# EAGLE design SAO_3 (EAGLE 9.6.2)
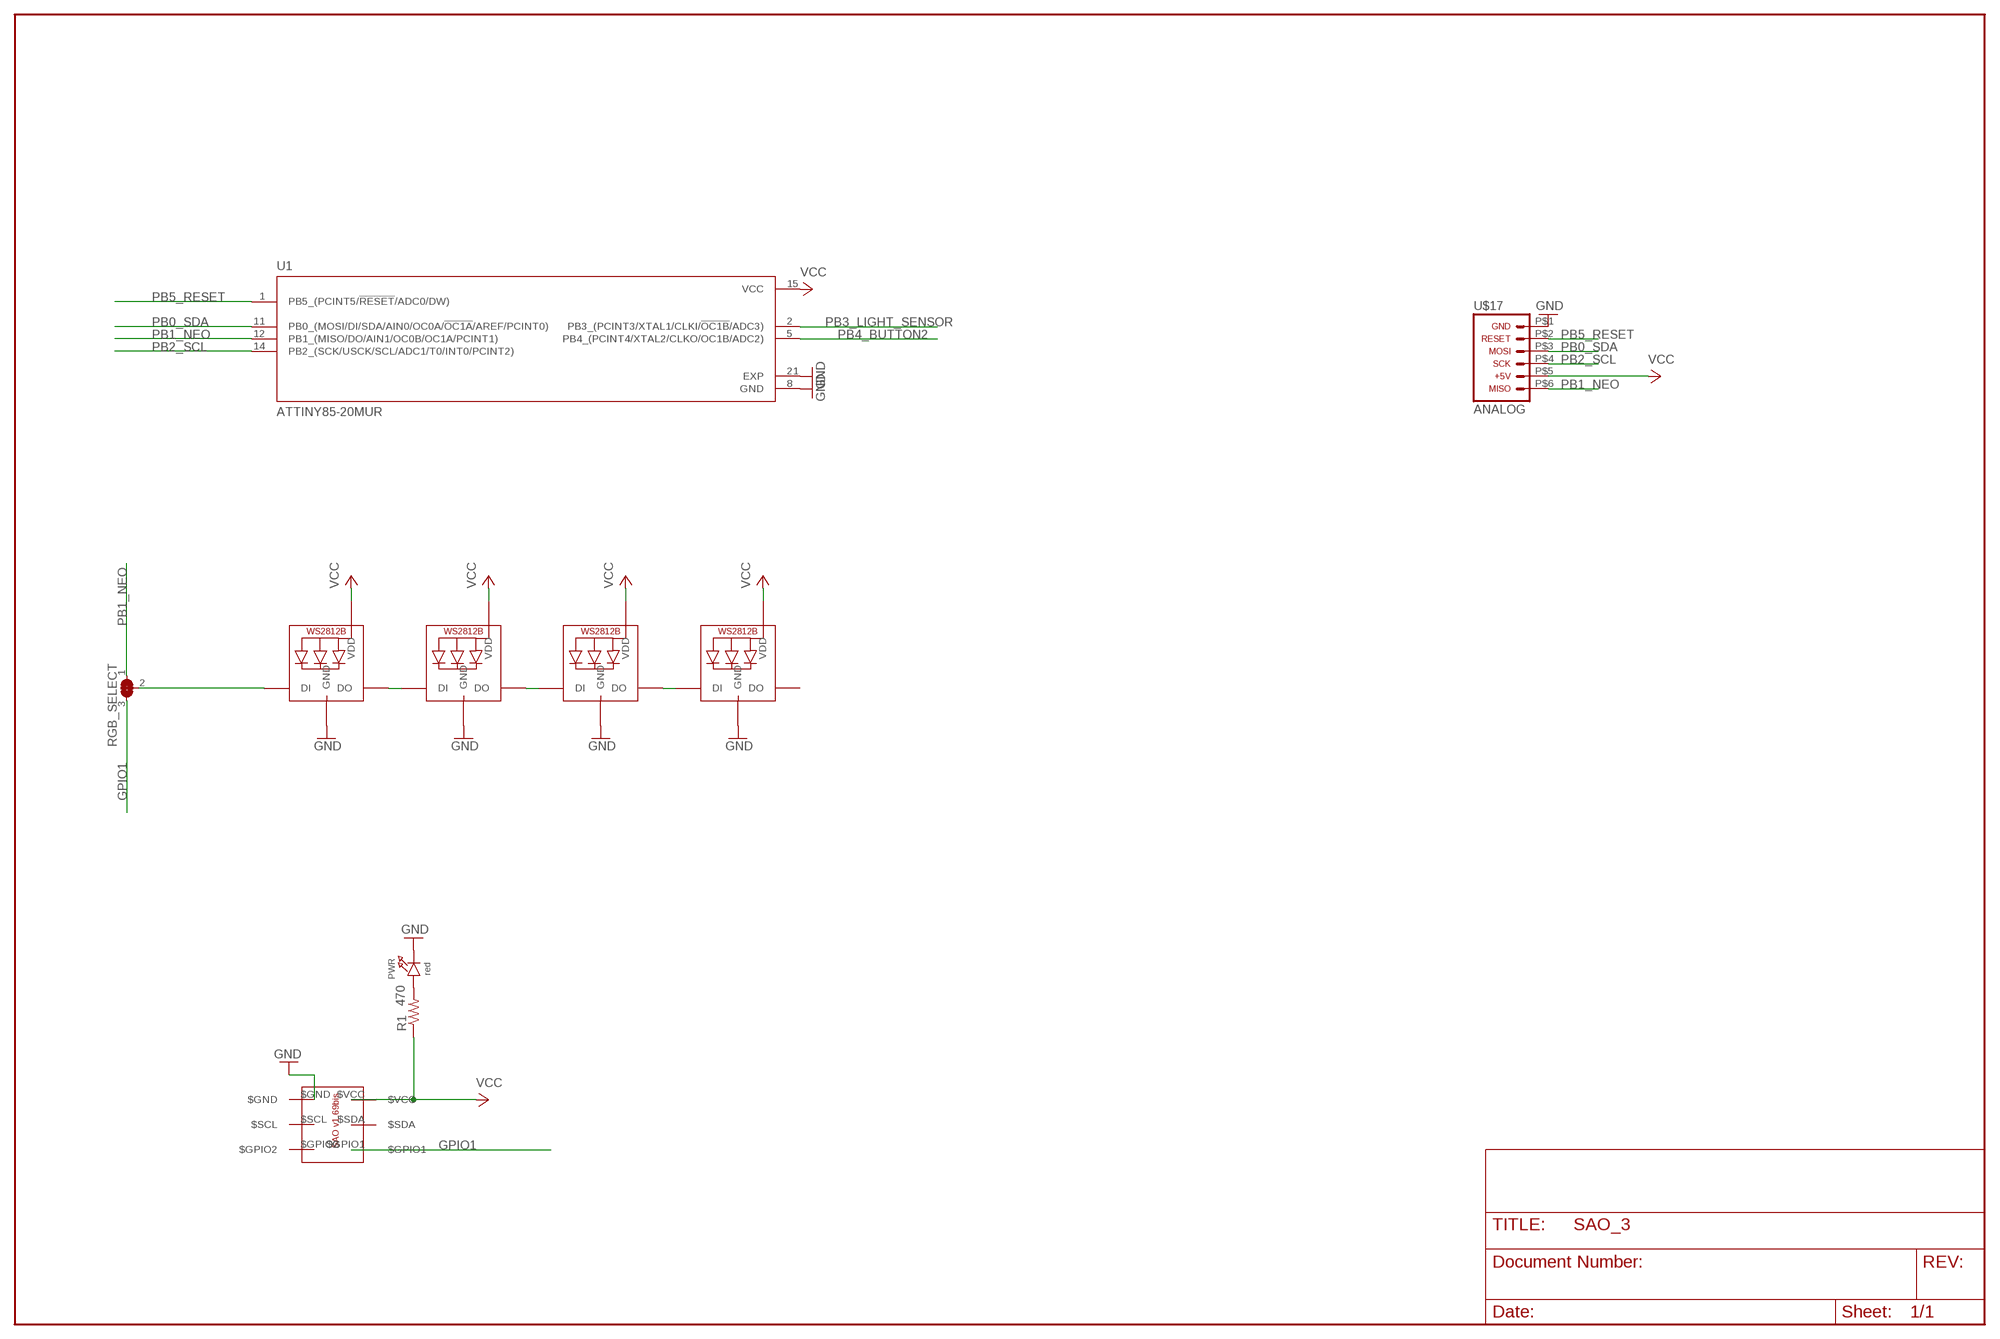
[diagram p0: schematic, sheet 1]

## Parts
LED1  WS2812B3535  [LED3535]
LED2  WS2812B3535  [LED3535]
LED3  WS2812B3535  [LED3535]
LED4  WS2812B3535  [LED3535]
PWR  red  LED0805_NOOUTLINE  [CHIPLED_0805_NOOUTLINE]
R1  470  R-US_R0805  [R0805]
RGB_SELECT  SOLDERJUMPER_2WAY  [SOLDERJUMPER_2WAY_OPEN_NOPASTE]
U1  ATTINY85-20MUR  [QFN50P400X400X80-21N]
U$3  SAO-1.69  [2X3-SHROUDED-FEMALE]
U$17  ICSP_FLATSMD_2X3  [CONN-SMD-2X3]

## Nets
GND [PWR]: LED1.1(GND) LED2.1(GND) LED3.1(GND) LED4.1(GND) PWR.C U1.8(GND) U1.21(EXP) U$3.$GND U$17.P$1
GPIO1: RGB_SELECT.3 U$3.$GPIO1
N$5: LED1.2(DI) RGB_SELECT.2
N$7: PWR.A R1.2
N$8: LED3.4(DO) LED4.2(DI)
N$13: LED1.4(DO) LED2.2(DI)
N$14: LED2.4(DO) LED3.2(DI)
PB0_SDA: U1.11(PB0_(MOSI/DI/SDA/AIN0/OC0A/!OC1A!/AREF/PCINT0)) U$17.P$3
PB1_NEO: RGB_SELECT.1 U1.12(PB1_(MISO/DO/AIN1/OC0B/OC1A/PCINT1)) U$17.P$6
PB2_SCL: U1.14(PB2_(SCK/USCK/SCL/ADC1/T0/INT0/PCINT2)) U$17.P$4
PB3_LIGHT_SENSOR: U1.2(PB3_(PCINT3/XTAL1/CLKI/!OC1B!/ADC3))
PB4_BUTTON2: U1.5(PB4_(PCINT4/XTAL2/CLKO/OC1B/ADC2))
PB5_RESET: U1.1(PB5_(PCINT5/!RESET!/ADC0/DW)) U$17.P$2
VCC [PWR]: LED1.3(VDD) LED2.3(VDD) LED3.3(VDD) LED4.3(VDD) R1.1 U1.15(VCC) U$3.$VCC U$17.P$5
Unconnected: LED4.4(DO) U$3.$GPIO2 U$3.$SCL U$3.$SDA

## Library data of the parts
LED1-LED4 = TrophyParts:WS2812B
PWR = microbuilder:LED: LED 0603 - 0603 Surface Mount Package 2mA: Green LED - Low Power (3.9mcd, 2ma, 1.7Vf) - Digikey: 475-2709-2-ND Orange LED - Low Power (9.8mcd, 2ma, 1.8Vf) - Digikey: 475-1194-2-ND Red LED - Low Power (5mcd, 2ma, 1.8Vf) - Digikey: 475-1195-2-ND Yellow LED - Low Power (7mcd, 2ma, 1.8Vf) - Digikey: 475-1196-2-ND 5mA: Blue LED - Low Power (17mcd, 5ma, 2.9Vf) - Digikey: LNJ937W8CRACT-ND 0805 - 0805 Surface Mount Package 2mA: Red LED (8.8mcd, 2mA, 1.8Vf, Clear) - Low Power [Digikey: 475-2510-1-ND] Green LED (5mcd, 2mA, 1.8Vf, Clear) - Low Power [Digikey: 475-2730-1-ND] Yellow LED (11.3mcd, 2mA, 1.8Vf, Clear) - Low Power [Digikey: 475-2555-1-ND] 20mA: Red LED (104mcd, 20mA, Diffused) - LS R976 [Digikey: 475-1278-6-ND] Red LED (12mcd, 20mA, 2.0Vf, Clear) - APT2012EC [Digikey: 754-1128-1-ND] Green LED (15mcd, 20mA, 2.2Vf, Clear) - APT2012GC [Digikey: 754-1131-1-ND] Orange LED (160mcd, 20mA, 2.1Vf, Clear) - APT2012SECK [Digikey: 754-1130-1-ND] 1206 - 1206 Surface Mount Package Green LED (26mcd, 20mA, Diffused) - LG N971 [Digikey: 475-1407-6-ND] Red LED (15mcd, 20mA, Diffused) - LH N974 [Digikey: 475-1416-6-ND] Cree - Cree High-Power Surface Mount LEDs XPEBWT-L1-0000-00D50 - White 111lm 350mA 2.9Vf 6200K 110° XTEAWT-00-0000-00000LEE3 - White 114lm 350mA 2.85Vf 5000K 115° Everlight - Everlight 45-21 Series Surface Mount LEDs 45-21/QK2C-B2832AC2CB2/2T - Warm White 2000mcd 20mA 3.25Vf 3050K 120° 45-21/LK2C-B38452C4CB2/2T - Nuetral White 2000mcd 20mA 3.25Vf 4150K 120° 45-21/LK2C-B50634C6CB2/2T - Cold White 2200mcd 20mA 3.25Vf 5650K 120° PLCC2 Reverse Mount LS T77K-J1L2-1-0-2-R18-Z - Red 11.25mcd 2mA 1.8Vf 630nm 120° LO T77K-L1M2-24-Z - Orange 19.6mcd 2mA 1.8Vf 606nm 120° LY T77K-K2M1-26-Z - Yellow 15.7mcd 2mA 1.8Vf 587nm 120°
R1 = rcl:R-US_: RESISTOR, American symbol; SPICEPREFIX: R
RGB_SELECT = microbuilder:SOLDERJUMPER_2WAY: 2-Way Solder Jumper
U1 = ATTINY85-20MUR:ATTINY85-20MUR: AVR AVR® ATtiny Microcontroller IC 8-Bit 20MHz 8KB (4K x 16) FLASH 20-QFN-EP (4x4) Check prices <https://pricing.snapeda.com/parts/ATTINY85-20MUR/Atmel/view-part?ref=eda>; AVAILABILITY: In Stock; DESCRIPTION: AVR AVR® ATtiny, Functional Safety (FuSa) Microcontroller IC 8-Bit 20MHz 8KB (4K x 16) FLASH 20-QFN-EP (4x4); MF: Atmel; MP: ATTINY85-20MUR; PACKAGE: QFN-20 Atmel; PRICE: None
U$3 = Hatch2020:SAO-1.69
U$17 = TrophyParts:ICSP_FLAT

## Net classes
0 default: width 0.152 mm
1 PWR: width 0.254 mm
2 5V: width 0.508 mm
3 GND: width 0.254 mm

## Board
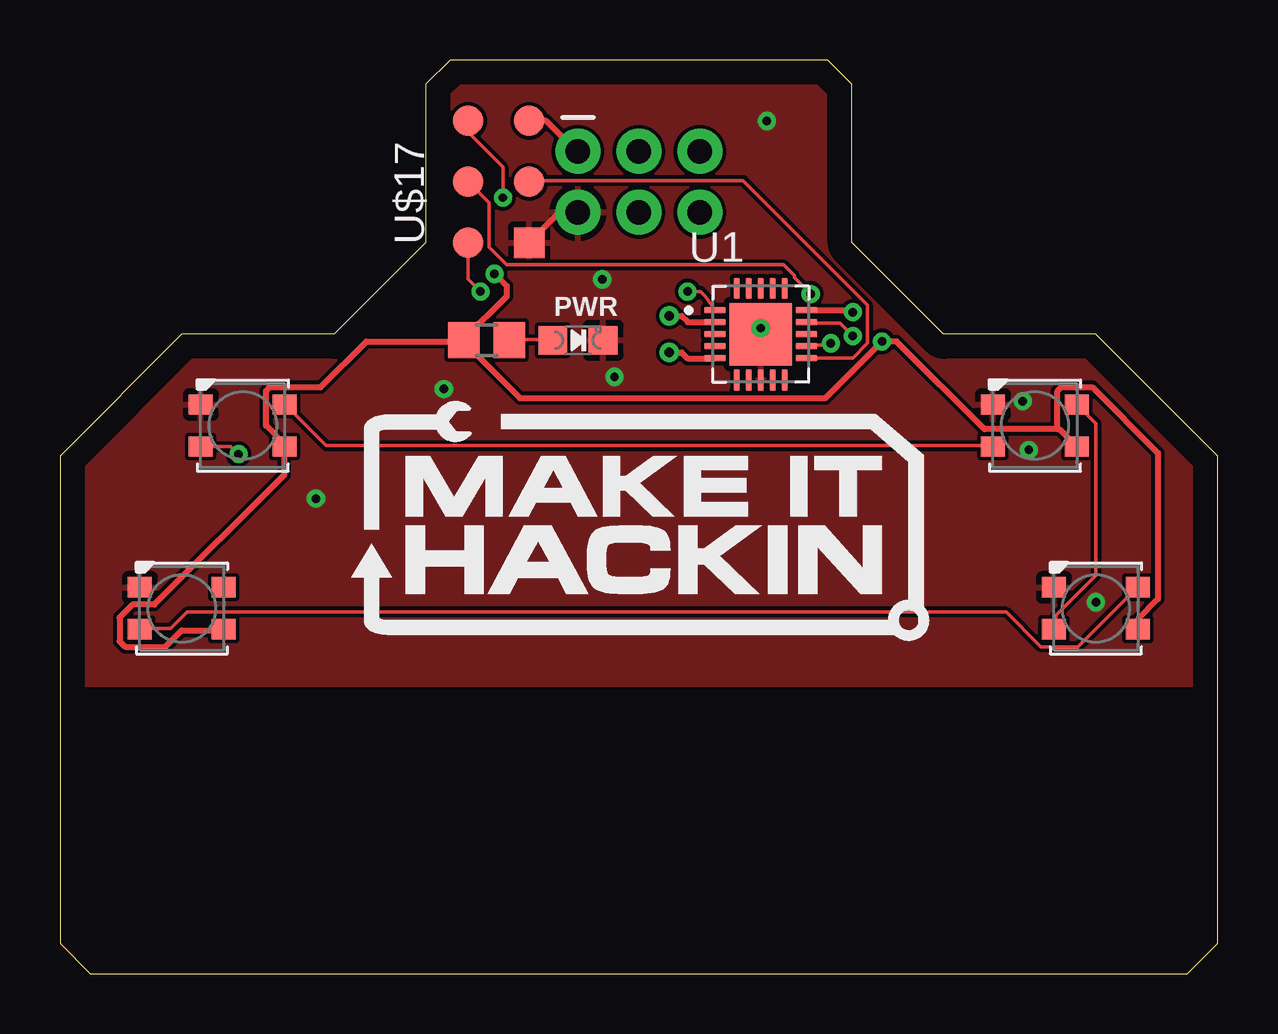
[diagram p1: board, top side]
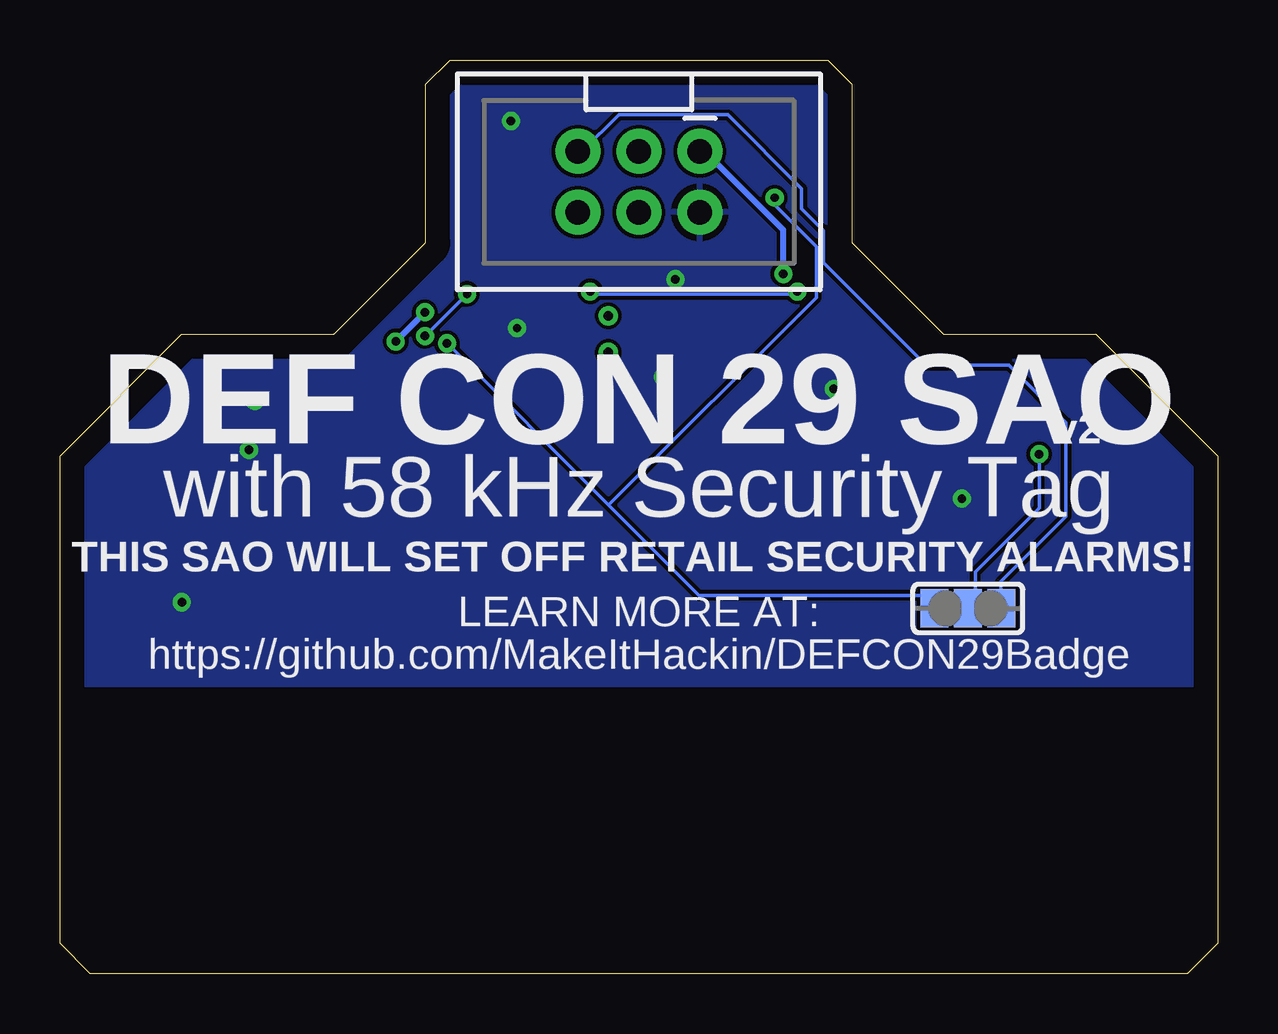
[diagram p2: board, bottom side, seen from below]

Size 48.26 x 38.1 mm. Coordinates in mm from the lower left corner, seen from the top.
Outline: 1.27,0 46.99,0 48.26,1.27 48.26,21.59 43.18,26.67 36.83,26.67 33.02,30.48 33.02,37.08 32,38.1 16.26,38.1 15.24,37.08 15.24,30.48 11.43,26.67 5.08,26.67 0,21.59 0,1.27 1.27,0
Copper layers (1*16): Top 0.035mm / dielectric 1.5mm / Bottom 0.035mm
Design rules "default *": minimum track width 6mil, minimum drill 0.35mm, track to track 6mil, track to pad 6mil, pad to pad 6mil, via to via 6mil, smd to smd 6mil, copper to edge 40mil, drill to drill 6mil, minimum pad ring 10mil, minimum via ring 8mil, stop-mask expansion 4mil, vias tented up to drill 15mil, thermal gap 10mil
tRestrict: area -1.5,-0.8 to 54.4,11.9
bRestrict: area -1.5,-1.5 to 54.6,11.9

### Footprints (pad centres in the part's own frame; a part is rotated, then mirrored left to right if it is on the bottom)
LED3535 = smd 1 x 0.85: 1 -1.75,0.875; 2 -1.75,-0.875; 3 1.75,-0.875; 4 1.75,0.875
CHIPLED_0805_NOOUTLINE = smd 1.2 x 1.2: A 0,-1.05; C 0,1.05
R0805 = smd 1.3 x 1.5: 1 -0.95,0; 2 0.95,0
SOLDERJUMPER_2WAY_OPEN_NOPASTE = smd 1.168 x 1.6: 1 -1.397,0; 2 0,0; 3 1.397,0
QFN50P400X400X80-21N = smd 0.89 x 0.26: 1 -1.91,1; 2 -1.91,0.5; 3 -1.91,0; 4 -1.91,-0.5; 5 -1.91,-1; 11 1.91,-1; 12 1.91,-0.5; 13 1.91,0; 14 1.91,0.5; 15 1.91,1 | smd 0.26 x 0.89: 6 -1,-1.91; 7 -0.5,-1.91; 8 0,-1.91; 9 0.5,-1.91; 10 1,-1.91; 16 1,1.91; 17 0.5,1.91; 18 0,1.91; 19 -0.5,1.91; 20 -1,1.91 | smd 2.6 x 2.6: 21 0,0
2X3-SHROUDED-FEMALE = drill 1.016 pad 1.88: $GND 1.27,2.54; $GPIO1 3.81,-2.54; $GPIO2 1.27,-2.54; $SCL 1.27,0; $SDA 3.81,0; $VCC 3.81,2.54
CONN-SMD-2X3 = smd 1.27 x 1.27: P$1 -2.54,-1.27; P$2 -2.54,1.27; P$3 0,-1.27; P$4 0,1.27; P$5 2.54,-1.27; P$6 2.54,1.27

### Placement (x,y rotation side)
LED1  7.62,22.86 0 top
LED2  40.64,22.86 0 top
LED3  43.18,15.24 0 top
LED4  5.08,15.24 0 top
PWR  21.59,26.42 270 top
R1  17.78,26.42 0 top
RGB_SELECT  10.41,15.24 0 bottom
U1  29.21,26.67 0 top
U$3  24.13,30.48 90 top
U$17  18.29,33.02 90 top

### Tracks (layer width: path | path; a pad name or v marks a point on that pad's centre or on a via)
GND  (via drill 0.35)
  Top 0.254: U$17.P$1 20.83,31.75 U$3.$GND
  other vias: 23.11,24.89 29.21,26.92 40.13,23.88 40.39,21.84 10.67,19.81 16,24.38 22.61,28.96 29.46,35.56 43.18,15.49
  pour Top: 14.22,39.88 10.41,39.88 -5.08,24.38 -5.59,23.88 -5.59,9.91 -5.59,-1.27 -3.05,-3.81 -1.78,-5.08 41.66,-5.08 58.17,-5.08 60.2,-3.05 60.2,18.03 58.42,19.81 58.42,24.89 51.05,32.26 43.94,39.37 34.54,39.37 34.04,39.88
  pour Bottom: 8.38,45.72 -9.65,27.69 -9.65,-1.78 63.5,-1.78 64.01,-2.29 64.01,18.8 41.66,41.15 37.08,45.72
GPIO1
  Bottom 0.152: U$3.$GPIO1 26.49,34.29 24.97,35.81 20.42,35.81 17.35,32.74 17.35,31.9 16.43,30.99 16.43,29.64 12.17,25.38 8.71,25.38 6.32,22.99 6.32,19.07 9.04,16.36 9.04,15.24 RGB_SELECT.3
N$5  (via drill 0.35)
  Top 0.152: v7.44,21.67 7.12,21.98 LED1.2
  Bottom 0.152: v7.44,21.67 7.44,19.43 10.11,16.76 10.11,15.54 RGB_SELECT.2
  Bottom 0.254: RGB_SELECT.2 12.19,15.24
N$7
  Top 0.152: PWR.A 20.47,26.44 18.8,26.44 R1.2
N$8
  Top 0.152: LED4.2 3.4,14.4 4.62,14.4 5.31,15.09 39.45,15.09 40.89,13.64 42.42,13.64 44.86,16.08 LED3.4
N$13
  Top 0.152: LED2.2 38.84,22.02 11.1,22.02 9.42,23.7 LED1.4
N$14
  Top 0.152: LED3.2 41.5,14.4 41.5,14.94 43.18,16.61 43.18,22.94 42.42,23.7 LED2.4
PB0_SDA
  Top 0.152: U1.11 31.14,25.68 33.05,25.68 33.66,26.29 33.66,27.89 28.47,33.07 19.61,33.07 U$17.P$3
PB1_NEO  (via drill 0.35)
  Top 0.152: v32.13,26.29 32.05,26.21 31.14,26.21 U1.12 | v18.47,32.36 18.47,33.63 17.04,35.05 17.04,35.51 U$17.P$6
  Bottom 0.152: 25.39,19.55 21.61,15.77 12.32,15.77 11.79,15.24 RGB_SELECT.1 | 25.39,19.55 v32.13,26.29 | v18.47,32.36 18.47,32.05 16.74,30.33 16.74,28.19 25.39,19.55
PB2_SCL  (via drill 0.35)
  Top 0.152: v33.05,26.59 32.51,27.13 31.14,27.13 U1.14 | v31.29,28.35 30.61,29.03 30.61,29.11 30.15,29.57 18.62,29.57 17.88,30.3 17.88,32.16 U$17.P$4
  Bottom 0.152: v31.29,28.35 v33.05,26.59
PB3_LIGHT_SENSOR  (via drill 0.4)
  Top 0.254: v25.4,27.43 25.91,27.43 26.17,27.17 U1.2
PB4_BUTTON2  (via drill 0.4)
  Top 0.254: v25.4,25.91 25.91,25.91 26.16,25.65 27.28,25.65 U1.5
PB5_RESET  (via drill 0.35)
  Top 0.152: U1.1 26.91,28.25 26.7,28.45 v26.16,28.45 | v17.53,28.45 17.02,28.96 U$17.P$2
  Bottom 0.152: v17.53,28.45 17.62,28.35 26.06,28.35 v26.16,28.45
VCC  (via drill 0.35)
  Top 0.254: v33.05,27.58 32.97,27.66 31.14,27.66 U1.15 | 41.58,22.71 41.66,22.71 42.34,22.02 LED2.3 | 41.58,22.71 38.53,22.71 34.87,26.36 v34.27,26.36 31.9,24 19.18,24 16.89,26.29 R1.1 | 41.58,22.71 41.58,24.31 41.73,24.46 43.03,24.46 45.77,21.72 45.77,15.62 44.93,14.78 44.93,14.4 LED3.3 | U$17.P$5 20.27,35.56 21.54,34.29 U$3.$VCC | LED4.3 6.76,14.33 5.08,14.33 4.39,13.64 2.72,13.64 2.49,13.87 2.49,14.86 3.02,15.39 3.94,15.39 9.35,20.8 9.35,21.95 LED1.3 9.35,22.1 8.59,22.86 8.59,24.31 8.74,24.46 10.87,24.46 12.78,26.36 16.82,26.36 R1.1 | v18.11,29.18 18.62,28.68 18.62,28.25 16.89,26.52 R1.1
  Bottom 0.254: v34.27,26.36 v33.05,27.58 | U$3.$VCC 21.39,34.29 18.11,31.01 v18.11,29.18

### Text on the board
tPlace: DEF CON 29 SAO
bPlace: v2 | DEF CON 29 SAO | with 58 kHz Security Tag | THIS SAO WILL SET OFF RETAIL SECURITY ALARMS! | LEARN MORE AT: | https://github.com/MakeItHackin/DEFCON29Badge